# EAGLE schematic candle (EAGLE 8.5.0)
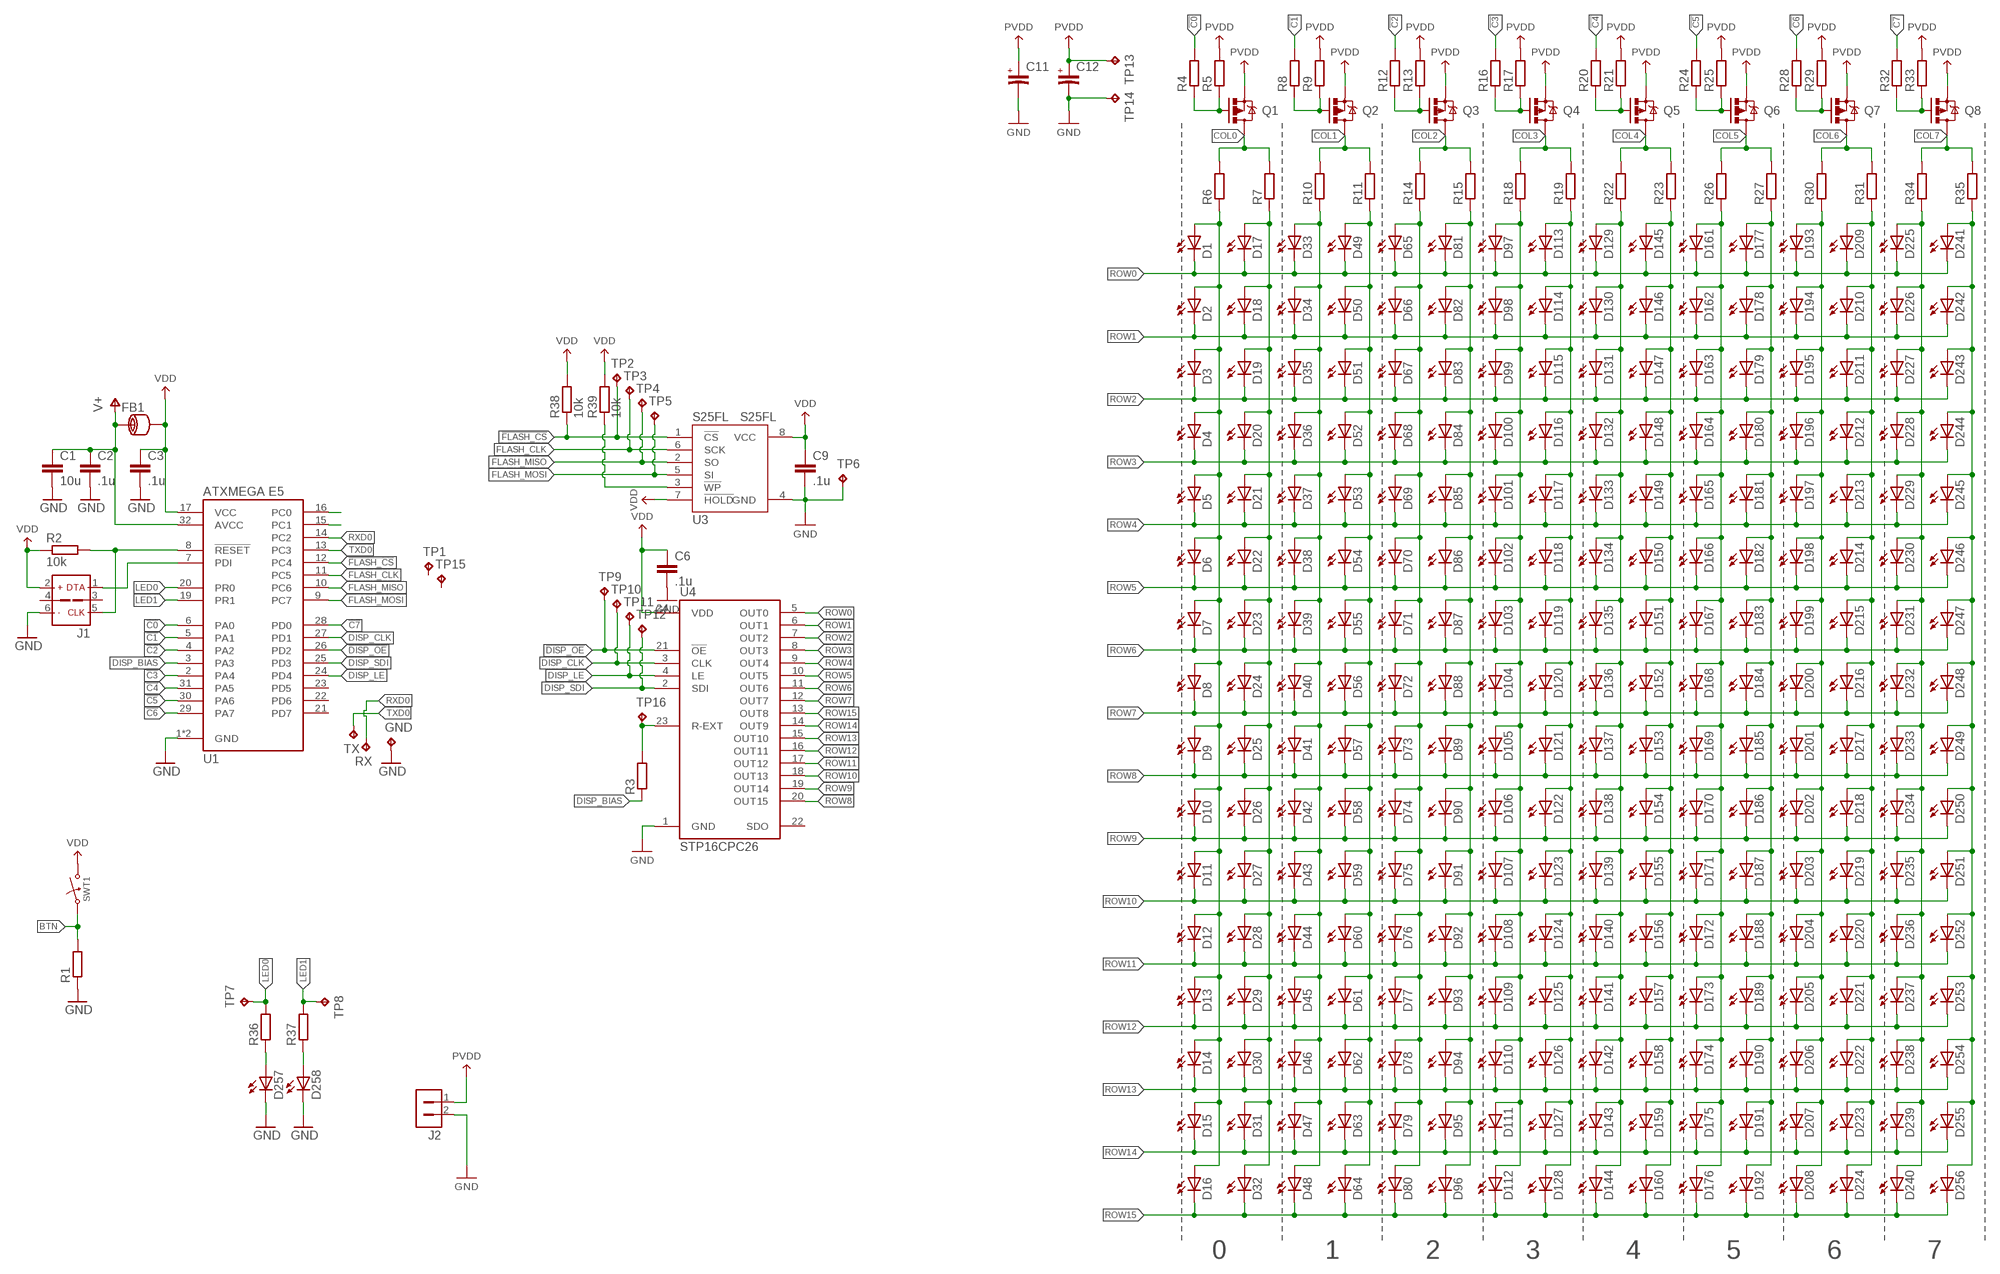
[diagram p0: schematic, sheet 1]

## Parts
C1  10u  C_0805  [0805]
C2  .1u  C_0805  [0805]
C3  .1u  C_0805  [0805]
C6  .1u  C_0805  [0805]
C9  .1u  C_0805  [0805]
C11  C_POL_1206  [1206_POL]
C12  C_POL_1206  [1206_POL]
D1  LED_0805  [0805_LED]
D2  LED_0805  [0805_LED]
D3  LED_0805  [0805_LED]
D4  LED_0805  [0805_LED]
D5  LED_0805  [0805_LED]
D6  LED_0805  [0805_LED]
D7  LED_0805  [0805_LED]
D8  LED_0805  [0805_LED]
D9  LED_0805  [0805_LED]
D10  LED_0805  [0805_LED]
D11  LED_0805  [0805_LED]
D12  LED_0805  [0805_LED]
D13  LED_0805  [0805_LED]
D14  LED_0805  [0805_LED]
D15  LED_0805  [0805_LED]
D16  LED_0805  [0805_LED]
D17  LED_0805  [0805_LED]
D18  LED_0805  [0805_LED]
D19  LED_0805  [0805_LED]
D20  LED_0805  [0805_LED]
D21  LED_0805  [0805_LED]
D22  LED_0805  [0805_LED]
D23  LED_0805  [0805_LED]
D24  LED_0805  [0805_LED]
D25  LED_0805  [0805_LED]
D26  LED_0805  [0805_LED]
D27  LED_0805  [0805_LED]
D28  LED_0805  [0805_LED]
D29  LED_0805  [0805_LED]
D30  LED_0805  [0805_LED]
D31  LED_0805  [0805_LED]
D32  LED_0805  [0805_LED]
D33  LED_0805  [0805_LED]
D34  LED_0805  [0805_LED]
D35  LED_0805  [0805_LED]
D36  LED_0805  [0805_LED]
D37  LED_0805  [0805_LED]
D38  LED_0805  [0805_LED]
D39  LED_0805  [0805_LED]
D40  LED_0805  [0805_LED]
D41  LED_0805  [0805_LED]
D42  LED_0805  [0805_LED]
D43  LED_0805  [0805_LED]
D44  LED_0805  [0805_LED]
D45  LED_0805  [0805_LED]
D46  LED_0805  [0805_LED]
D47  LED_0805  [0805_LED]
D48  LED_0805  [0805_LED]
D49  LED_0805  [0805_LED]
D50  LED_0805  [0805_LED]
D51  LED_0805  [0805_LED]
D52  LED_0805  [0805_LED]
D53  LED_0805  [0805_LED]
D54  LED_0805  [0805_LED]
D55  LED_0805  [0805_LED]
D56  LED_0805  [0805_LED]
D57  LED_0805  [0805_LED]
D58  LED_0805  [0805_LED]
D59  LED_0805  [0805_LED]
D60  LED_0805  [0805_LED]
D61  LED_0805  [0805_LED]
D62  LED_0805  [0805_LED]
D63  LED_0805  [0805_LED]
D64  LED_0805  [0805_LED]
D65  LED_0805  [0805_LED]
D66  LED_0805  [0805_LED]
D67  LED_0805  [0805_LED]
D68  LED_0805  [0805_LED]
D69  LED_0805  [0805_LED]
D70  LED_0805  [0805_LED]
D71  LED_0805  [0805_LED]
D72  LED_0805  [0805_LED]
D73  LED_0805  [0805_LED]
D74  LED_0805  [0805_LED]
D75  LED_0805  [0805_LED]
D76  LED_0805  [0805_LED]
D77  LED_0805  [0805_LED]
D78  LED_0805  [0805_LED]
D79  LED_0805  [0805_LED]
D80  LED_0805  [0805_LED]
D81  LED_0805  [0805_LED]
D82  LED_0805  [0805_LED]
D83  LED_0805  [0805_LED]
D84  LED_0805  [0805_LED]
D85  LED_0805  [0805_LED]
D86  LED_0805  [0805_LED]
D87  LED_0805  [0805_LED]
D88  LED_0805  [0805_LED]
D89  LED_0805  [0805_LED]
D90  LED_0805  [0805_LED]
D91  LED_0805  [0805_LED]
D92  LED_0805  [0805_LED]
D93  LED_0805  [0805_LED]
D94  LED_0805  [0805_LED]
D95  LED_0805  [0805_LED]
D96  LED_0805  [0805_LED]
D97  LED_0805  [0805_LED]
D98  LED_0805  [0805_LED]
D99  LED_0805  [0805_LED]
D100  LED_0805  [0805_LED]
D101  LED_0805  [0805_LED]
D102  LED_0805  [0805_LED]
D103  LED_0805  [0805_LED]
D104  LED_0805  [0805_LED]
D105  LED_0805  [0805_LED]
D106  LED_0805  [0805_LED]
D107  LED_0805  [0805_LED]
D108  LED_0805  [0805_LED]
D109  LED_0805  [0805_LED]
D110  LED_0805  [0805_LED]
D111  LED_0805  [0805_LED]
D112  LED_0805  [0805_LED]
D113  LED_0805  [0805_LED]
D114  LED_0805  [0805_LED]
D115  LED_0805  [0805_LED]
D116  LED_0805  [0805_LED]
D117  LED_0805  [0805_LED]
D118  LED_0805  [0805_LED]
D119  LED_0805  [0805_LED]
D120  LED_0805  [0805_LED]
D121  LED_0805  [0805_LED]
D122  LED_0805  [0805_LED]
D123  LED_0805  [0805_LED]
D124  LED_0805  [0805_LED]
D125  LED_0805  [0805_LED]
D126  LED_0805  [0805_LED]
D127  LED_0805  [0805_LED]
D128  LED_0805  [0805_LED]
D129  LED_0805  [0805_LED]
D130  LED_0805  [0805_LED]
D131  LED_0805  [0805_LED]
D132  LED_0805  [0805_LED]
D133  LED_0805  [0805_LED]
D134  LED_0805  [0805_LED]
D135  LED_0805  [0805_LED]
D136  LED_0805  [0805_LED]
D137  LED_0805  [0805_LED]
D138  LED_0805  [0805_LED]
D139  LED_0805  [0805_LED]
D140  LED_0805  [0805_LED]
D141  LED_0805  [0805_LED]
D142  LED_0805  [0805_LED]
D143  LED_0805  [0805_LED]
D144  LED_0805  [0805_LED]
D145  LED_0805  [0805_LED]
D146  LED_0805  [0805_LED]
D147  LED_0805  [0805_LED]
D148  LED_0805  [0805_LED]
D149  LED_0805  [0805_LED]
D150  LED_0805  [0805_LED]
D151  LED_0805  [0805_LED]
D152  LED_0805  [0805_LED]
D153  LED_0805  [0805_LED]
D154  LED_0805  [0805_LED]
D155  LED_0805  [0805_LED]
D156  LED_0805  [0805_LED]
D157  LED_0805  [0805_LED]
D158  LED_0805  [0805_LED]
D159  LED_0805  [0805_LED]
D160  LED_0805  [0805_LED]
D161  LED_0805  [0805_LED]
D162  LED_0805  [0805_LED]
D163  LED_0805  [0805_LED]
D164  LED_0805  [0805_LED]
D165  LED_0805  [0805_LED]
D166  LED_0805  [0805_LED]
D167  LED_0805  [0805_LED]
D168  LED_0805  [0805_LED]
D169  LED_0805  [0805_LED]
D170  LED_0805  [0805_LED]
D171  LED_0805  [0805_LED]
D172  LED_0805  [0805_LED]
D173  LED_0805  [0805_LED]
D174  LED_0805  [0805_LED]
D175  LED_0805  [0805_LED]
D176  LED_0805  [0805_LED]
D177  LED_0805  [0805_LED]
D178  LED_0805  [0805_LED]
D179  LED_0805  [0805_LED]
D180  LED_0805  [0805_LED]
D181  LED_0805  [0805_LED]
D182  LED_0805  [0805_LED]
D183  LED_0805  [0805_LED]
D184  LED_0805  [0805_LED]
D185  LED_0805  [0805_LED]
D186  LED_0805  [0805_LED]
D187  LED_0805  [0805_LED]
D188  LED_0805  [0805_LED]
D189  LED_0805  [0805_LED]
D190  LED_0805  [0805_LED]
D191  LED_0805  [0805_LED]
D192  LED_0805  [0805_LED]
D193  LED_0805  [0805_LED]
D194  LED_0805  [0805_LED]
D195  LED_0805  [0805_LED]
D196  LED_0805  [0805_LED]
D197  LED_0805  [0805_LED]
D198  LED_0805  [0805_LED]
D199  LED_0805  [0805_LED]
D200  LED_0805  [0805_LED]
D201  LED_0805  [0805_LED]
D202  LED_0805  [0805_LED]
D203  LED_0805  [0805_LED]
D204  LED_0805  [0805_LED]
D205  LED_0805  [0805_LED]
D206  LED_0805  [0805_LED]
D207  LED_0805  [0805_LED]
D208  LED_0805  [0805_LED]
D209  LED_0805  [0805_LED]
D210  LED_0805  [0805_LED]
D211  LED_0805  [0805_LED]
D212  LED_0805  [0805_LED]
D213  LED_0805  [0805_LED]
D214  LED_0805  [0805_LED]
D215  LED_0805  [0805_LED]
D216  LED_0805  [0805_LED]
D217  LED_0805  [0805_LED]
D218  LED_0805  [0805_LED]
D219  LED_0805  [0805_LED]
D220  LED_0805  [0805_LED]
D221  LED_0805  [0805_LED]
D222  LED_0805  [0805_LED]
D223  LED_0805  [0805_LED]
D224  LED_0805  [0805_LED]
D225  LED_0805  [0805_LED]
D226  LED_0805  [0805_LED]
D227  LED_0805  [0805_LED]
D228  LED_0805  [0805_LED]
D229  LED_0805  [0805_LED]
D230  LED_0805  [0805_LED]
D231  LED_0805  [0805_LED]
D232  LED_0805  [0805_LED]
D233  LED_0805  [0805_LED]
D234  LED_0805  [0805_LED]
D235  LED_0805  [0805_LED]
D236  LED_0805  [0805_LED]
D237  LED_0805  [0805_LED]
D238  LED_0805  [0805_LED]
D239  LED_0805  [0805_LED]
D240  LED_0805  [0805_LED]
D241  LED_0805  [0805_LED]
D242  LED_0805  [0805_LED]
D243  LED_0805  [0805_LED]
D244  LED_0805  [0805_LED]
D245  LED_0805  [0805_LED]
D246  LED_0805  [0805_LED]
D247  LED_0805  [0805_LED]
D248  LED_0805  [0805_LED]
D249  LED_0805  [0805_LED]
D250  LED_0805  [0805_LED]
D251  LED_0805  [0805_LED]
D252  LED_0805  [0805_LED]
D253  LED_0805  [0805_LED]
D254  LED_0805  [0805_LED]
D255  LED_0805  [0805_LED]
D256  LED_0805  [0805_LED]
D257  LED_0805  [0805_LED]
D258  LED_0805  [0805_LED]
FB1  FB_0603  [0603]
GND  TPB1,27  [B1,27]
J1  PDI_LOCK  [2X3_LOCK]
J2  1X2_MOLEX_53254  [1X2_MOLEX_53254]
Q1  PMV160UP  [SOT23]
Q2  PMV160UP  [SOT23]
Q3  PMV160UP  [SOT23]
Q4  PMV160UP  [SOT23]
Q5  PMV160UP  [SOT23]
Q6  PMV160UP  [SOT23]
Q7  PMV160UP  [SOT23]
Q8  PMV160UP  [SOT23]
R1  R_0603  [0603]
R2  10k  R_0805  [0805]
R3  R_0603  [0603]
R4  R_0603  [0603]
R5  R_0603  [0603]
R6  R_0603  [0603]
R7  R_0603  [0603]
R8  R_0603  [0603]
R9  R_0603  [0603]
R10  R_0603  [0603]
R11  R_0603  [0603]
R12  R_0603  [0603]
R13  R_0603  [0603]
R14  R_0603  [0603]
R15  R_0603  [0603]
R16  R_0603  [0603]
R17  R_0603  [0603]
R18  R_0603  [0603]
R19  R_0603  [0603]
R20  R_0603  [0603]
R21  R_0603  [0603]
R22  R_0603  [0603]
R23  R_0603  [0603]
R24  R_0603  [0603]
R25  R_0603  [0603]
R26  R_0603  [0603]
R27  R_0603  [0603]
R28  R_0603  [0603]
R29  R_0603  [0603]
R30  R_0603  [0603]
R31  R_0603  [0603]
R32  R_0603  [0603]
R33  R_0603  [0603]
R34  R_0603  [0603]
R35  R_0603  [0603]
R36  R_0603  [0603]
R37  R_0603  [0603]
R38  10k  R_0603  [0603]
R39  10k  R_0603  [0603]
RX  TPB1,27  [B1,27]
SWT1  BUTTON_SMD_2P  [BTN_SMD_2PIN]
TP1  TPB1,27  [B1,27]
TP2  TPB1,27  [B1,27]
TP3  TPB1,27  [B1,27]
TP4  TPB1,27  [B1,27]
TP5  TPB1,27  [B1,27]
TP6  TPB1,27  [B1,27]
TP7  TPB1,27  [B1,27]
TP8  TPB1,27  [B1,27]
TP9  TPB1,27  [B1,27]
TP10  TPB1,27  [B1,27]
TP11  TPB1,27  [B1,27]
TP12  TPB1,27  [B1,27]
TP13  TPB1,27  [B1,27]
TP14  TPB1,27  [B1,27]
TP15  TPB1,27  [B1,27]
TP16  TPB1,27  [B1,27]
TX  TPB1,27  [B1,27]
U1  ATXMEGA_E5_TQFP  [TQFP32]
U3  S25FL  [SO8]
U4  STP16CPC26TSSOP24  [TSSOP24]

## Nets
!C0: R4.2 U1.6(PA0)
!C0_: Q1.1(G) R4.1 R5.1
!C1: R8.2 U1.5(PA1)
!C2: R12.2 U1.4(PA2)
!C3: R16.2 U1.2(PA4)
!C3_: Q4.1(G) R16.1 R17.1
!C4: R20.2 U1.31(PA5)
!C5: R24.2 U1.30(PA6)
!C5_: Q6.1(G) R24.1 R25.1
!C6: R28.2 U1.29(PA7)
!C6_: Q7.1(G) R28.1 R29.1
!C7: R32.2 U1.28(PD0)
!C7_: Q8.1(G) R32.1 R33.1
!DISP_OE: TP9.TP U1.26(PD2) U4.21(!OE)
!FLASH_CS: R38.1 TP2.TP U1.12(PC4) U3.1(!CS)
!RESET: J1.5(CLK) R2.2 U1.8(!RESET)
BTN: R1.2 SWT1.1
COL0: Q1.3(D) R6.2 R7.2
COL1: Q2.3(D) R10.2 R11.2
COL2: Q3.3(D) R14.2 R15.2
COL3: Q4.3(D) R18.2 R19.2
COL4: Q5.3(D) R22.2 R23.2
COL5: Q6.3(D) R26.2 R27.2
COL6: Q7.3(D) R30.2 R31.2
COL7: Q8.3(D) R34.2 R35.2
DISP_BIAS: R3.1 U1.3(PA3)
DISP_CLK: TP10.TP U1.27(PD1) U4.3(CLK)
DISP_LE: TP11.TP U1.24(PD4) U4.4(LE)
DISP_SDI: TP12.TP U1.25(PD3) U4.2(SDI)
FLASH_CLK: TP3.TP U1.11(PC5) U3.6(SCK)
FLASH_MISO: TP4.TP U1.10(PC6) U3.2(SO)
FLASH_MOSI: TP5.TP U1.9(PC7) U3.5(SI)
GND: C1.2 C2.2 C3.2 C6.2 C9.2 C11.2 C12.2 D257.C D258.C GND.TP J1.6(GND) J2.2 R1.1 TP6.TP TP14.TP U1.1(GND) U1.18(GND) U3.4(GND) U4.1(GND)
LED0: R36.2 TP7.TP U1.20(PR0)
LED1: R37.2 TP8.TP U1.19(PR1)
N$1: D257.A R36.1
N$2: D1.A D2.A D3.A D4.A D5.A D6.A D7.A D8.A D9.A D10.A D11.A D12.A D13.A D14.A D15.A D16.A R6.1
N$3: D17.A D18.A D19.A D20.A D21.A D22.A D23.A D24.A D25.A D26.A D27.A D28.A D29.A D30.A D31.A D32.A R7.1
N$5: D258.A R37.1
N$6: R39.1 U3.3(!WP)
N$7: Q2.1(G) R8.1 R9.1
N$8: D65.A D66.A D67.A D68.A D69.A D70.A D71.A D72.A D73.A D74.A D75.A D76.A D77.A D78.A D79.A D80.A R14.1
N$9: D81.A D82.A D83.A D84.A D85.A D86.A D87.A D88.A D89.A D90.A D91.A D92.A D93.A D94.A D95.A D96.A R15.1
N$10: R3.2 TP16.TP U4.23(R-EXT)
N$11: D129.A D130.A D131.A D132.A D133.A D134.A D135.A D136.A D137.A D138.A D139.A D140.A D141.A D142.A D143.A D144.A R22.1
N$12: D145.A D146.A D147.A D148.A D149.A D150.A D151.A D152.A D153.A D154.A D155.A D156.A D157.A D158.A D159.A D160.A R23.1
N$13: Q3.1(G) R12.1 R13.1
N$14: Q5.1(G) R20.1 R21.1
N$15: U1.15(PC1)
N$16: U1.16(PC0)
N$33: D97.A D98.A D99.A D100.A D101.A D102.A D103.A D104.A D105.A D106.A D107.A D108.A D109.A D110.A D111.A D112.A R18.1
N$35: D113.A D114.A D115.A D116.A D117.A D118.A D119.A D120.A D121.A D122.A D123.A D124.A D125.A D126.A D127.A D128.A R19.1
N$42: D161.A D162.A D163.A D164.A D165.A D166.A D167.A D168.A D169.A D170.A D171.A D172.A D173.A D174.A D175.A D176.A R26.1
N$44: D177.A D178.A D179.A D180.A D181.A D182.A D183.A D184.A D185.A D186.A D187.A D188.A D189.A D190.A D191.A D192.A R27.1
N$47: D193.A D194.A D195.A D196.A D197.A D198.A D199.A D200.A D201.A D202.A D203.A D204.A D205.A D206.A D207.A D208.A R30.1
N$48: D209.A D210.A D211.A D212.A D213.A D214.A D215.A D216.A D217.A D218.A D219.A D220.A D221.A D222.A D223.A D224.A R31.1
N$51: D225.A D226.A D227.A D228.A D229.A D230.A D231.A D232.A D233.A D234.A D235.A D236.A D237.A D238.A D239.A D240.A R34.1
N$52: D241.A D242.A D243.A D244.A D245.A D246.A D247.A D248.A D249.A D250.A D251.A D252.A D253.A D254.A D255.A D256.A R35.1
N$53: D33.A D34.A D35.A D36.A D37.A D38.A D39.A D40.A D41.A D42.A D43.A D44.A D45.A D46.A D47.A D48.A R10.1
N$54: D49.A D50.A D51.A D52.A D53.A D54.A D55.A D56.A D57.A D58.A D59.A D60.A D61.A D62.A D63.A D64.A R11.1
PDI: J1.1(DATA) U1.7(PDI)
PVDD: C11.1 C12.1 J2.1 Q1.2(S) Q2.2(S) Q3.2(S) Q4.2(S) Q5.2(S) Q6.2(S) Q7.2(S) Q8.2(S) R5.2 R9.2 R13.2 R17.2 R21.2 R25.2 R29.2 R33.2 TP13.TP
ROW0: D1.C D17.C D33.C D49.C D65.C D81.C D97.C D113.C D129.C D145.C D161.C D177.C D193.C D209.C D225.C D241.C U4.5(OUT0)
ROW1: D2.C D18.C D34.C D50.C D66.C D82.C D98.C D114.C D130.C D146.C D162.C D178.C D194.C D210.C D226.C D242.C U4.6(OUT1)
ROW2: D3.C D19.C D35.C D51.C D67.C D83.C D99.C D115.C D131.C D147.C D163.C D179.C D195.C D211.C D227.C D243.C U4.7(OUT2)
ROW3: D4.C D20.C D36.C D52.C D68.C D84.C D100.C D116.C D132.C D148.C D164.C D180.C D196.C D212.C D228.C D244.C U4.8(OUT3)
ROW4: D5.C D21.C D37.C D53.C D69.C D85.C D101.C D117.C D133.C D149.C D165.C D181.C D197.C D213.C D229.C D245.C U4.9(OUT4)
ROW5: D6.C D22.C D38.C D54.C D70.C D86.C D102.C D118.C D134.C D150.C D166.C D182.C D198.C D214.C D230.C D246.C U4.10(OUT5)
ROW6: D7.C D23.C D39.C D55.C D71.C D87.C D103.C D119.C D135.C D151.C D167.C D183.C D199.C D215.C D231.C D247.C U4.11(OUT6)
ROW7: D8.C D24.C D40.C D56.C D72.C D88.C D104.C D120.C D136.C D152.C D168.C D184.C D200.C D216.C D232.C D248.C U4.12(OUT7)
ROW8: D9.C D25.C D41.C D57.C D73.C D89.C D105.C D121.C D137.C D153.C D169.C D185.C D201.C D217.C D233.C D249.C U4.20(OUT15)
ROW9: D10.C D26.C D42.C D58.C D74.C D90.C D106.C D122.C D138.C D154.C D170.C D186.C D202.C D218.C D234.C D250.C U4.19(OUT14)
ROW10: D11.C D27.C D43.C D59.C D75.C D91.C D107.C D123.C D139.C D155.C D171.C D187.C D203.C D219.C D235.C D251.C U4.18(OUT13)
ROW11: D12.C D28.C D44.C D60.C D76.C D92.C D108.C D124.C D140.C D156.C D172.C D188.C D204.C D220.C D236.C D252.C U4.17(OUT12)
ROW12: D13.C D29.C D45.C D61.C D77.C D93.C D109.C D125.C D141.C D157.C D173.C D189.C D205.C D221.C D237.C D253.C U4.16(OUT11)
ROW13: D14.C D30.C D46.C D62.C D78.C D94.C D110.C D126.C D142.C D158.C D174.C D190.C D206.C D222.C D238.C D254.C U4.15(OUT10)
ROW14: D15.C D31.C D47.C D63.C D79.C D95.C D111.C D127.C D143.C D159.C D175.C D191.C D207.C D223.C D239.C D255.C U4.14(OUT9)
ROW15: D16.C D32.C D48.C D64.C D80.C D96.C D112.C D128.C D144.C D160.C D176.C D192.C D208.C D224.C D240.C D256.C U4.13(OUT8)
RXD0: RX.TP U1.14(PC2)
TXD0: TX.TP U1.13(PC3)
V+: C1.1 C2.1 FB1.1 U1.32(AVCC)
VDD: C3.1 C6.1 C9.1 FB1.2 J1.2(VCC) R2.1 R38.2 R39.2 SWT1.2 U1.17(VCC) U3.7(!HOLD) U3.8(VCC) U4.24(VDD)
Unconnected: J1.3 J1.4 TP1.TP TP15.TP U1.21(PD7) U1.22(PD6) U1.23(PD5) U4.22(SDO)

## Notes on the sheet
- 0 | 1 | 2 | 3 | 4 | 5 | 6 | 7

## Library data of the parts
C1-C3 C6 C9 = Sebastian:C
C11 C12 = Sebastian:C_POL
D1-D258 = Sebastian 2:LED
FB1 = Sebastian:FB: Ferrites
GND RX TP1-TP16 TX = testpad:TP: Test pad
J1 = Sebastian:PDI
J2 = Sebastian:1X2
Q1-Q8 = Sebastian:PMV160UP: 20 V, 1.2 A P-channel Trench MOSFET - Datasheet <http://www.nxp.com/documents/data_sheet/PMV160UP.pdf>
R1 R3-R39 = Sebastian 2:R
R2 = Sebastian:R
SWT1 = Sebastian:BUTTON
U1 = Sebastian:ATXMEGA_E5: ATXMEGA E5 Dataheet <http://www.atmel.com/Images/Atmel-8153-8-and-16-bit-AVR-Microcontroller-XMEGA-E-ATxmega8E5-ATxmega16E5-ATxmega32E5_Datasheet.pdf>
U3 = Sebastian:S25FL
U4 = Sebastian:STP16CPC26